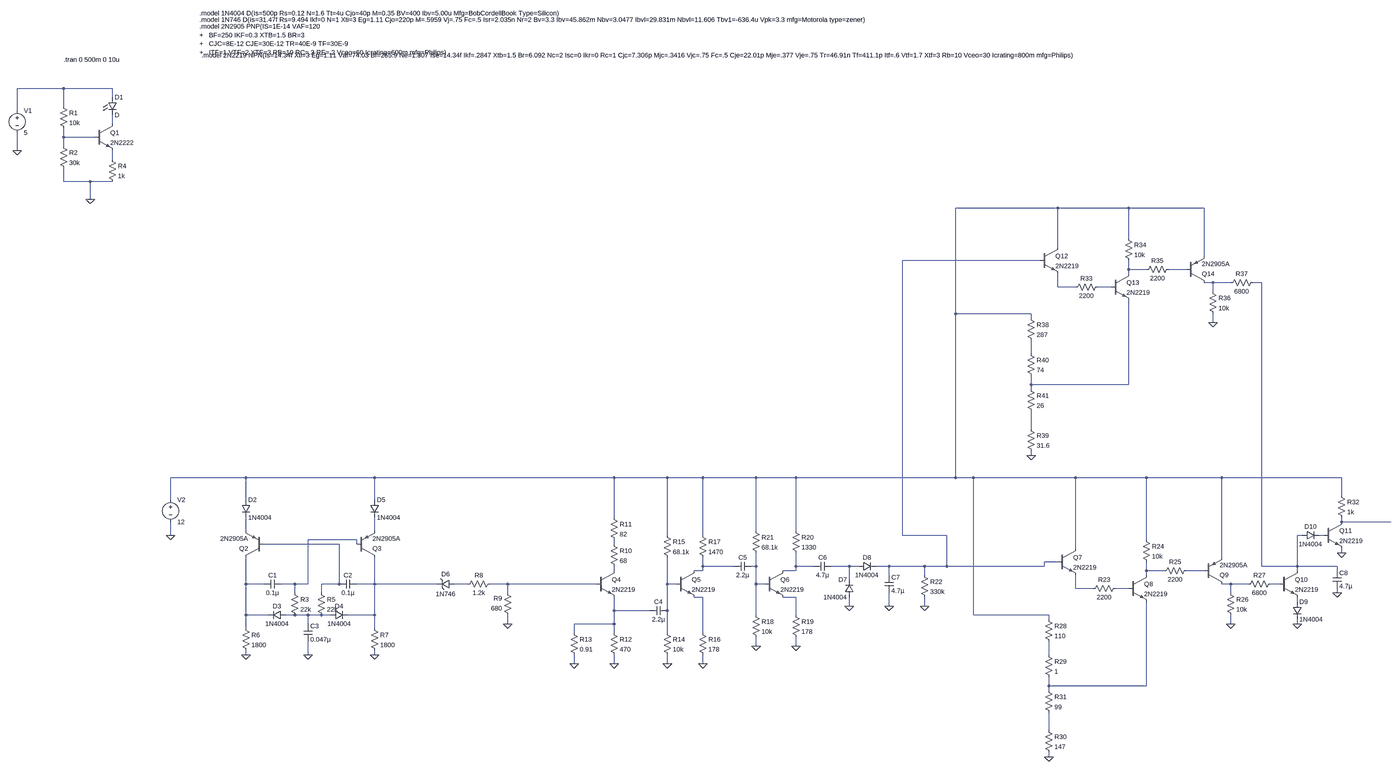
[diagram p0: schematic working_model.asc, whole sheet]
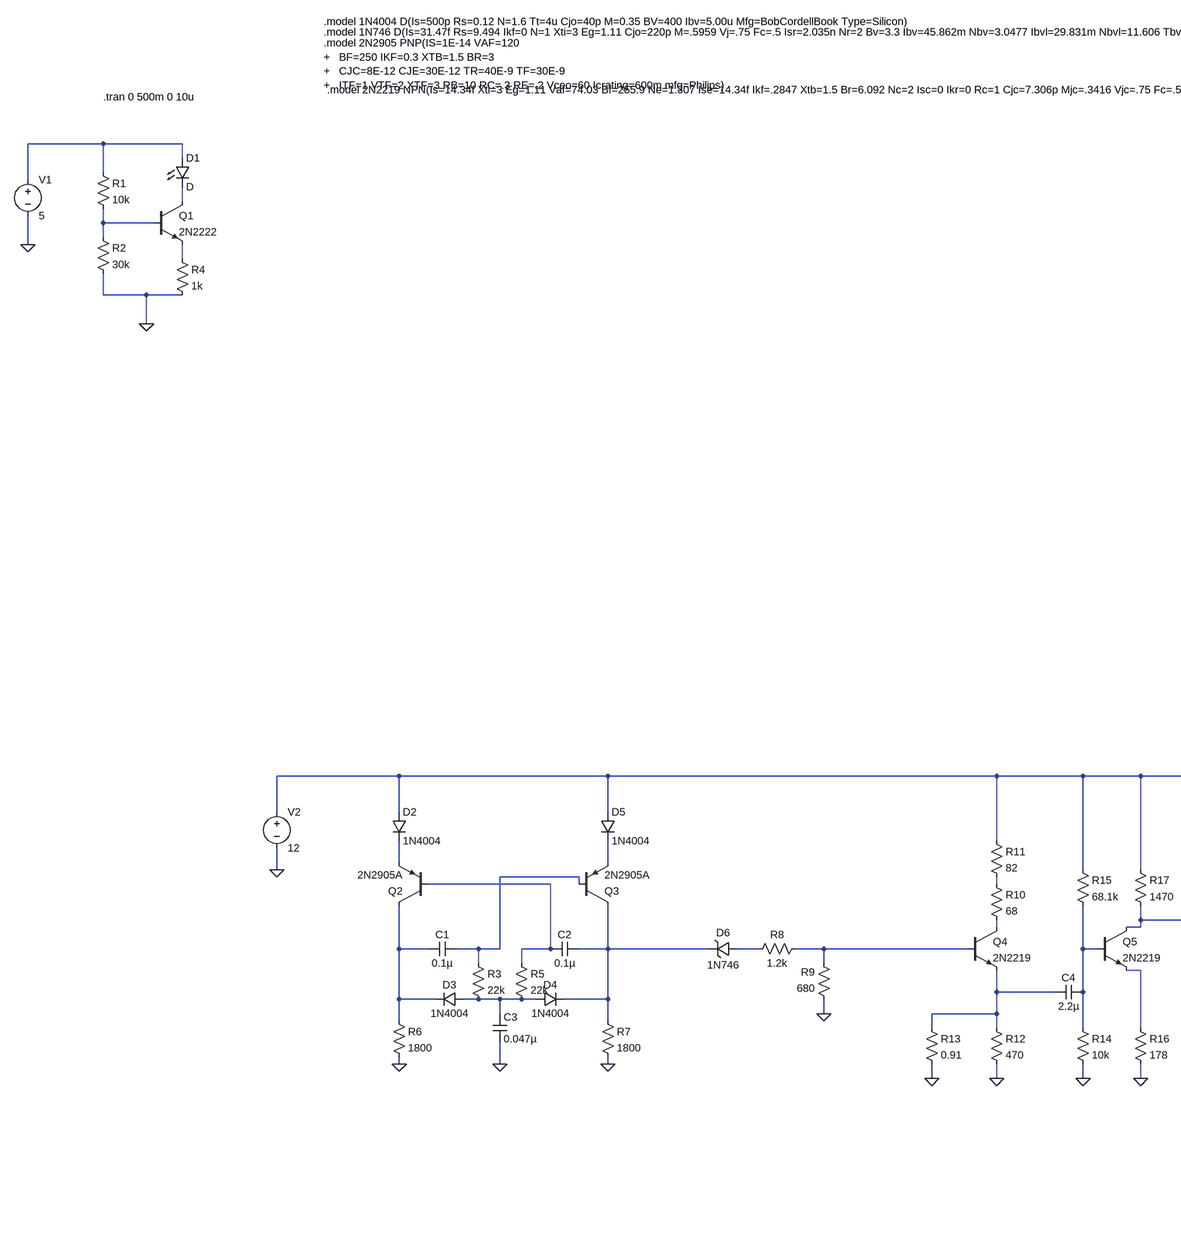
[diagram p1: schematic working_model.asc, part, row 1 of 1, column 1 of 2]
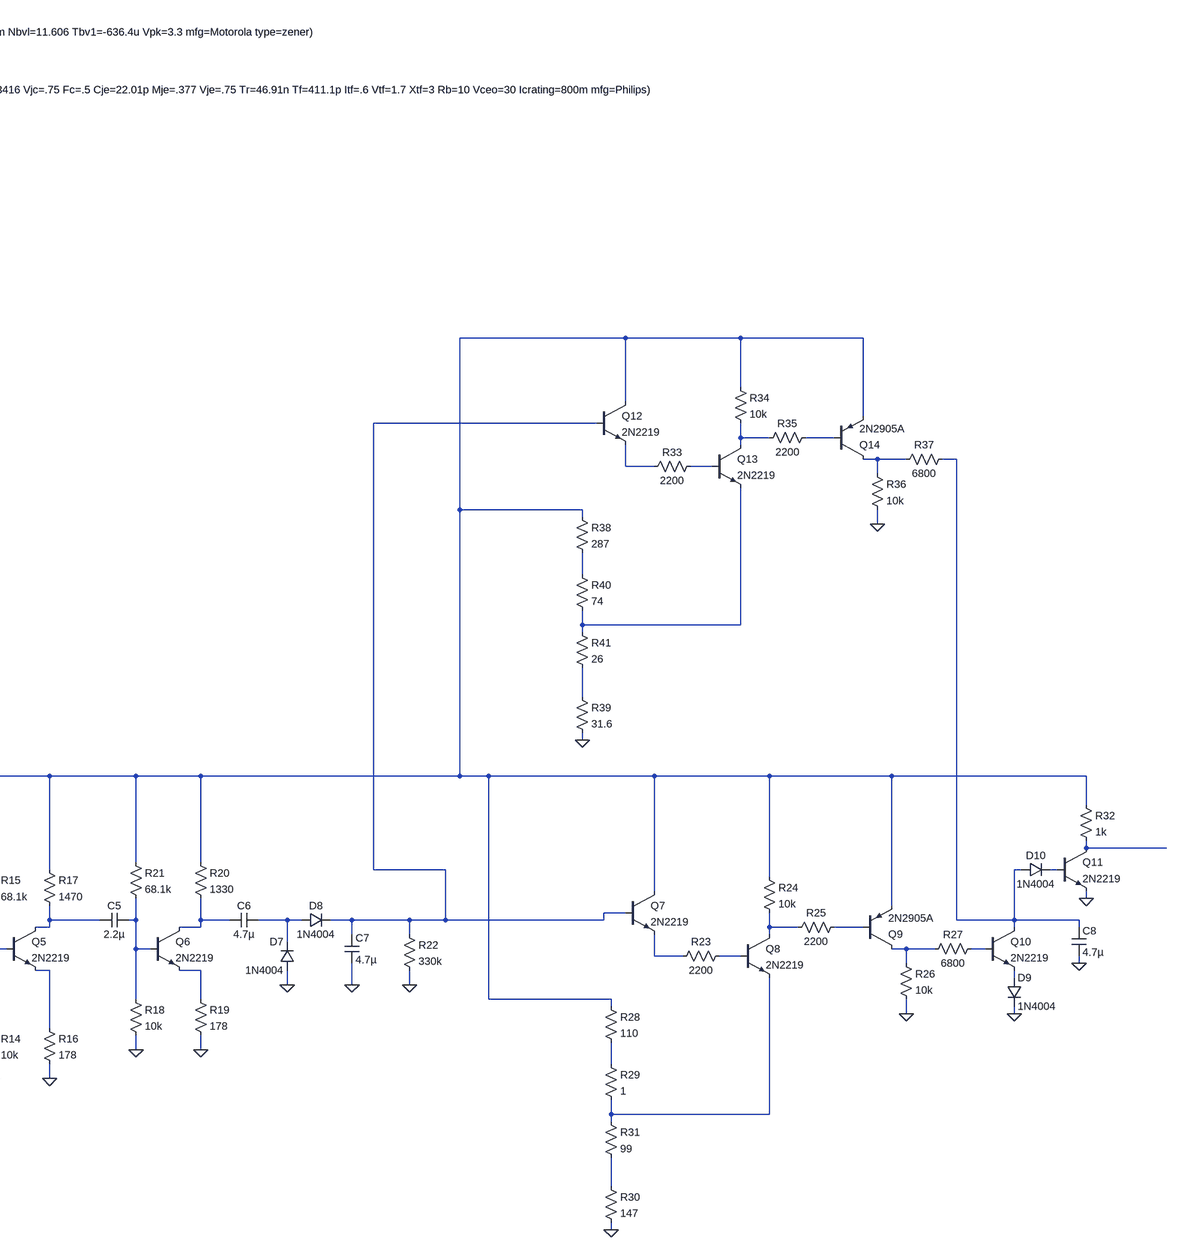
[diagram p2: schematic working_model.asc, part, row 1 of 1, column 2 of 2]
working_model.asc, the LTspice schematic file:
Version 4
SHEET 1 5364 2564
WIRE 80 16 -96 16
WIRE 256 16 80 16
WIRE 256 48 256 16
WIRE 80 80 80 16
WIRE -96 96 -96 16
WIRE 256 144 256 112
WIRE 80 192 80 160
WIRE 192 192 80 192
WIRE 80 224 80 192
WIRE -96 240 -96 176
WIRE 256 272 256 240
WIRE 80 352 80 304
WIRE 176 352 80 352
WIRE 256 352 176 352
WIRE 176 416 176 352
WIRE 4064 448 3696 448
WIRE 4320 448 4064 448
WIRE 4592 448 4320 448
WIRE 4320 672 4320 448
WIRE 4064 704 4064 448
WIRE 4592 736 4592 448
WIRE 4000 752 3504 752
WIRE 4320 784 4320 752
WIRE 4384 784 4320 784
WIRE 4528 784 4464 784
WIRE 4320 800 4320 784
WIRE 4624 832 4592 832
WIRE 4688 832 4624 832
WIRE 4800 832 4768 832
WIRE 4064 848 4064 800
WIRE 4128 848 4064 848
WIRE 4256 848 4208 848
WIRE 4624 864 4624 832
WIRE 3696 944 3696 448
WIRE 3968 944 3696 944
WIRE 3968 960 3968 944
WIRE 4624 976 4624 944
WIRE 3968 1088 3968 1040
WIRE 3968 1200 3968 1168
WIRE 4320 1200 4320 896
WIRE 4320 1200 3968 1200
WIRE 3968 1216 3968 1200
WIRE 3968 1360 3968 1296
WIRE 3968 1456 3968 1440
WIRE 1136 1536 864 1536
WIRE 1600 1536 1136 1536
WIRE 2464 1536 1600 1536
WIRE 2656 1536 2464 1536
WIRE 2784 1536 2656 1536
WIRE 2976 1536 2784 1536
WIRE 3120 1536 2976 1536
WIRE 3696 1536 3696 944
WIRE 3696 1536 3120 1536
WIRE 3760 1536 3696 1536
WIRE 4128 1536 3760 1536
WIRE 4384 1536 4128 1536
WIRE 4656 1536 4384 1536
WIRE 5088 1536 4656 1536
WIRE 5088 1600 5088 1536
WIRE 864 1616 864 1536
WIRE 1136 1616 1136 1536
WIRE 1600 1616 1600 1536
WIRE 2464 1680 2464 1536
WIRE 5088 1696 5088 1680
WIRE 5360 1696 5088 1696
WIRE 1136 1728 1136 1680
WIRE 1600 1728 1600 1680
WIRE 2976 1728 2976 1536
WIRE 3120 1728 3120 1536
WIRE 864 1744 864 1696
WIRE 2656 1744 2656 1536
WIRE 2784 1744 2784 1536
WIRE 3504 1744 3504 752
WIRE 3664 1744 3504 1744
WIRE 4944 1744 4928 1744
WIRE 5024 1744 5008 1744
WIRE 1536 1760 1360 1760
WIRE 4384 1760 4384 1536
WIRE 1472 1776 1200 1776
WIRE 1536 1776 1536 1760
WIRE 2464 1776 2464 1760
WIRE 4128 1792 4128 1536
WIRE 5088 1808 5088 1792
WIRE 4656 1824 4656 1536
WIRE 4064 1840 4016 1840
WIRE 2784 1856 2784 1824
WIRE 2896 1856 2784 1856
WIRE 2976 1856 2976 1808
WIRE 2976 1856 2960 1856
WIRE 3120 1856 3120 1808
WIRE 3184 1856 3120 1856
WIRE 3312 1856 3248 1856
WIRE 3344 1856 3312 1856
WIRE 3456 1856 3408 1856
WIRE 3584 1856 3456 1856
WIRE 3664 1856 3664 1744
WIRE 3664 1856 3584 1856
WIRE 4016 1856 4016 1840
WIRE 4016 1856 3664 1856
WIRE 4800 1856 4800 832
WIRE 4928 1856 4928 1744
WIRE 4928 1856 4800 1856
WIRE 5072 1856 4928 1856
WIRE 2464 1872 2464 1856
WIRE 2784 1872 2784 1856
WIRE 2784 1872 2752 1872
WIRE 3120 1872 3120 1856
WIRE 3120 1872 3072 1872
WIRE 4384 1872 4384 1840
WIRE 4448 1872 4384 1872
WIRE 4592 1872 4528 1872
WIRE 4928 1872 4928 1856
WIRE 5072 1872 5072 1856
WIRE 3456 1888 3456 1856
WIRE 3584 1888 3584 1856
WIRE 4384 1888 4384 1872
WIRE 3312 1904 3312 1856
WIRE 1136 1920 1136 1824
WIRE 1200 1920 1136 1920
WIRE 1312 1920 1264 1920
WIRE 1360 1920 1360 1760
WIRE 1360 1920 1312 1920
WIRE 1472 1920 1472 1776
WIRE 1472 1920 1408 1920
WIRE 1600 1920 1600 1824
WIRE 1600 1920 1536 1920
WIRE 1824 1920 1600 1920
WIRE 1936 1920 1888 1920
WIRE 2080 1920 2016 1920
WIRE 2400 1920 2080 1920
WIRE 2656 1920 2656 1824
WIRE 2688 1920 2656 1920
WIRE 2976 1920 2976 1856
WIRE 3008 1920 2976 1920
WIRE 4688 1920 4656 1920
WIRE 4752 1920 4688 1920
WIRE 4864 1920 4832 1920
WIRE 4128 1936 4128 1888
WIRE 4192 1936 4128 1936
WIRE 4320 1936 4272 1936
WIRE 1312 1952 1312 1920
WIRE 1408 1952 1408 1920
WIRE 2080 1952 2080 1920
WIRE 4688 1952 4688 1920
WIRE 5072 1952 5072 1936
WIRE 2784 1968 2752 1968
WIRE 3120 1968 3072 1968
WIRE 4928 1984 4928 1968
WIRE 3312 2000 3312 1968
WIRE 3456 2000 3456 1952
WIRE 3584 2000 3584 1968
WIRE 2464 2016 2464 1968
WIRE 2592 2016 2464 2016
WIRE 2656 2016 2656 1920
WIRE 1136 2032 1136 1920
WIRE 1216 2032 1136 2032
WIRE 1312 2032 1280 2032
WIRE 1360 2032 1312 2032
WIRE 1408 2032 1360 2032
WIRE 1440 2032 1408 2032
WIRE 1600 2032 1600 1920
WIRE 1600 2032 1504 2032
WIRE 2976 2032 2976 1920
WIRE 3120 2032 3120 1968
WIRE 3760 2032 3760 1536
WIRE 4032 2032 3760 2032
WIRE 4032 2048 4032 2032
WIRE 1360 2064 1360 2032
WIRE 2080 2064 2080 2032
WIRE 2464 2064 2464 2016
WIRE 2464 2064 2320 2064
WIRE 4688 2064 4688 2032
WIRE 4928 2064 4928 2048
WIRE 1136 2080 1136 2032
WIRE 1600 2080 1600 2032
WIRE 2320 2096 2320 2064
WIRE 2464 2096 2464 2064
WIRE 2656 2096 2656 2016
WIRE 2784 2096 2784 1968
WIRE 2976 2144 2976 2112
WIRE 3120 2144 3120 2112
WIRE 1136 2176 1136 2160
WIRE 1360 2176 1360 2128
WIRE 1600 2176 1600 2160
WIRE 4032 2176 4032 2128
WIRE 2320 2208 2320 2176
WIRE 2464 2208 2464 2176
WIRE 2656 2208 2656 2176
WIRE 2784 2208 2784 2176
WIRE 4032 2288 4032 2256
WIRE 4384 2288 4384 1984
WIRE 4384 2288 4032 2288
WIRE 4032 2304 4032 2288
WIRE 4032 2448 4032 2384
WIRE 4032 2544 4032 2528
FLAG 176 416 0
FLAG -96 240 0
FLAG 864 1744 0
FLAG 1136 2176 0
FLAG 1360 2176 0
FLAG 1600 2176 0
FLAG 2080 2064 0
FLAG 2464 2208 0
FLAG 2320 2208 0
FLAG 2656 2208 0
FLAG 2784 2208 0
FLAG 2976 2144 0
FLAG 3120 2144 0
FLAG 3312 2000 0
FLAG 3456 2000 0
FLAG 3584 2000 0
FLAG 4688 2064 0
FLAG 4928 2064 0
FLAG 4032 2544 0
FLAG 5088 1808 0
FLAG 5072 1952 0
FLAG 4624 976 0
FLAG 3968 1456 0
SYMBOL res 64 64 R0
SYMATTR InstName R1
SYMATTR Value 10k
SYMBOL res 64 208 R0
SYMATTR InstName R2
SYMATTR Value 30k
SYMBOL npn 192 144 R0
SYMATTR InstName Q1
SYMATTR Value 2N2222
SYMBOL res 240 256 R0
SYMATTR InstName R4
SYMATTR Value 1k
SYMBOL voltage -96 80 R0
WINDOW 123 0 0 Left 0
WINDOW 39 0 0 Left 0
SYMATTR InstName V1
SYMATTR Value 5
SYMBOL LED 240 48 R0
SYMATTR InstName D1
SYMBOL voltage 864 1600 R0
WINDOW 123 0 0 Left 0
WINDOW 39 0 0 Left 0
SYMATTR InstName V2
SYMATTR Value 12
SYMBOL diode 1120 1616 R0
SYMATTR InstName D2
SYMATTR Value 1N4004
SYMBOL pnp 1200 1824 R180
SYMATTR InstName Q2
SYMATTR Value 2N2905A
SYMBOL pnp 1536 1824 M180
SYMATTR InstName Q3
SYMATTR Value 2N2905A
SYMBOL cap 1264 1904 R90
WINDOW 0 0 32 VBottom 2
WINDOW 3 32 32 VTop 2
SYMATTR InstName C1
SYMATTR Value 0.1µ
SYMBOL cap 1536 1904 R90
WINDOW 0 0 32 VBottom 2
WINDOW 3 32 32 VTop 2
SYMATTR InstName C2
SYMATTR Value 0.1µ
SYMBOL res 1296 1936 R0
SYMATTR InstName R3
SYMATTR Value 22k
SYMBOL res 1392 1936 R0
SYMATTR InstName R5
SYMATTR Value 22k
SYMBOL cap 1344 2064 R0
SYMATTR InstName C3
SYMATTR Value 0.047µ
SYMBOL diode 1280 2016 R90
WINDOW 0 0 32 VBottom 2
WINDOW 3 32 32 VTop 2
SYMATTR InstName D3
SYMATTR Value 1N4004
SYMBOL diode 1440 2048 R270
WINDOW 0 32 32 VTop 2
WINDOW 3 0 32 VBottom 2
SYMATTR InstName D4
SYMATTR Value 1N4004
SYMBOL res 1120 2064 R0
SYMATTR InstName R6
SYMATTR Value 1800
SYMBOL res 1584 2064 R0
SYMATTR InstName R7
SYMATTR Value 1800
SYMBOL diode 1584 1616 R0
SYMATTR InstName D5
SYMATTR Value 1N4004
SYMBOL zener 1888 1904 R90
WINDOW 0 -4 32 VBottom 2
WINDOW 3 36 32 VTop 2
SYMATTR InstName D6
SYMATTR Value 1N746
SYMBOL res 2032 1904 R90
WINDOW 0 0 56 VBottom 2
WINDOW 3 32 56 VTop 2
SYMATTR InstName R8
SYMATTR Value 1.2k
SYMBOL res 2096 2048 R180
WINDOW 0 36 76 Left 2
WINDOW 3 36 40 Left 2
SYMATTR InstName R9
SYMATTR Value 680
SYMBOL npn 2400 1872 R0
SYMATTR InstName Q4
SYMATTR Value 2N2219
SYMBOL res 2448 1760 R0
SYMATTR InstName R10
SYMATTR Value 68
SYMBOL res 2448 1664 R0
SYMATTR InstName R11
SYMATTR Value 82
SYMBOL res 2448 2080 R0
SYMATTR InstName R12
SYMATTR Value 470
SYMBOL res 2304 2080 R0
SYMATTR InstName R13
SYMATTR Value 0.91
SYMBOL cap 2656 2000 R90
WINDOW 0 0 32 VBottom 2
WINDOW 3 32 32 VTop 2
SYMATTR InstName C4
SYMATTR Value 2.2µ
SYMBOL npn 2688 1872 R0
SYMATTR InstName Q5
SYMATTR Value 2N2219
SYMBOL res 2640 2080 R0
SYMATTR InstName R14
SYMATTR Value 10k
SYMBOL res 2640 1728 R0
SYMATTR InstName R15
SYMATTR Value 68.1k
SYMBOL res 2768 2080 R0
SYMATTR InstName R16
SYMATTR Value 178
SYMBOL res 2768 1728 R0
SYMATTR InstName R17
SYMATTR Value 1470
SYMBOL cap 2896 1872 R270
WINDOW 0 32 32 VTop 2
WINDOW 3 0 32 VBottom 2
SYMATTR InstName C5
SYMATTR Value 2.2µ
SYMBOL npn 3008 1872 R0
SYMATTR InstName Q6
SYMATTR Value 2N2219
SYMBOL res 2960 2016 R0
SYMATTR InstName R18
SYMATTR Value 10k
SYMBOL res 3104 2016 R0
SYMATTR InstName R19
SYMATTR Value 178
SYMBOL res 3104 1712 R0
SYMATTR InstName R20
SYMATTR Value 1330
SYMBOL res 2960 1712 R0
SYMATTR InstName R21
SYMATTR Value 68.1k
SYMBOL cap 3248 1840 R90
WINDOW 0 0 32 VBottom 2
WINDOW 3 32 32 VTop 2
SYMATTR InstName C6
SYMATTR Value 4.7µ
SYMBOL diode 3328 1968 R180
WINDOW 0 24 64 Left 2
WINDOW 3 24 0 Left 2
SYMATTR InstName D7
SYMATTR Value 1N4004
SYMBOL diode 3344 1872 R270
WINDOW 0 32 32 VTop 2
WINDOW 3 0 32 VBottom 2
SYMATTR InstName D8
SYMATTR Value 1N4004
SYMBOL cap 3440 1888 R0
SYMATTR InstName C7
SYMATTR Value 4.7µ
SYMBOL res 3568 1872 R0
SYMATTR InstName R22
SYMATTR Value 330k
SYMBOL npn 4064 1792 R0
SYMATTR InstName Q7
SYMATTR Value 2N2219
SYMBOL res 4288 1920 R90
WINDOW 0 0 56 VBottom 2
WINDOW 3 32 56 VTop 2
SYMATTR InstName R23
SYMATTR Value 2200
SYMBOL npn 4320 1888 R0
SYMATTR InstName Q8
SYMATTR Value 2N2219
SYMBOL res 4368 1744 R0
SYMATTR InstName R24
SYMATTR Value 10k
SYMBOL res 4544 1856 R90
WINDOW 0 0 56 VBottom 2
WINDOW 3 32 56 VTop 2
SYMATTR InstName R25
SYMATTR Value 2200
SYMBOL pnp 4592 1920 M180
SYMATTR InstName Q9
SYMATTR Value 2N2905A
SYMBOL res 4672 1936 R0
SYMATTR InstName R26
SYMATTR Value 10k
SYMBOL res 4848 1904 R90
WINDOW 0 0 56 VBottom 2
WINDOW 3 32 56 VTop 2
SYMATTR InstName R27
SYMATTR Value 6800
SYMBOL npn 4864 1872 R0
SYMATTR InstName Q10
SYMATTR Value 2N2219
SYMBOL diode 4912 1984 R0
SYMATTR InstName D9
SYMATTR Value 1N4004
SYMBOL res 4016 2032 R0
SYMATTR InstName R28
SYMATTR Value 110
SYMBOL res 4016 2432 R0
SYMATTR InstName R30
SYMATTR Value 147
SYMBOL res 4016 2160 R0
SYMATTR InstName R29
SYMATTR Value 1
SYMBOL res 4016 2288 R0
SYMATTR InstName R31
SYMATTR Value 99
SYMBOL diode 4944 1760 R270
WINDOW 0 32 32 VTop 2
WINDOW 3 0 32 VBottom 2
SYMATTR InstName D10
SYMATTR Value 1N4004
SYMBOL npn 5024 1696 R0
SYMATTR InstName Q11
SYMATTR Value 2N2219
SYMBOL res 5072 1584 R0
SYMATTR InstName R32
SYMATTR Value 1k
SYMBOL cap 5056 1872 R0
SYMATTR InstName C8
SYMATTR Value 4.7µ
SYMBOL npn 4000 704 R0
SYMATTR InstName Q12
SYMATTR Value 2N2219
SYMBOL res 4224 832 R90
WINDOW 0 0 56 VBottom 2
WINDOW 3 32 56 VTop 2
SYMATTR InstName R33
SYMATTR Value 2200
SYMBOL npn 4256 800 R0
SYMATTR InstName Q13
SYMATTR Value 2N2219
SYMBOL res 4304 656 R0
SYMATTR InstName R34
SYMATTR Value 10k
SYMBOL res 4480 768 R90
WINDOW 0 0 56 VBottom 2
WINDOW 3 32 56 VTop 2
SYMATTR InstName R35
SYMATTR Value 2200
SYMBOL pnp 4528 832 M180
SYMATTR InstName Q14
SYMATTR Value 2N2905A
SYMBOL res 4608 848 R0
SYMATTR InstName R36
SYMATTR Value 10k
SYMBOL res 4784 816 R90
WINDOW 0 0 56 VBottom 2
WINDOW 3 32 56 VTop 2
SYMATTR InstName R37
SYMATTR Value 6800
SYMBOL res 3952 944 R0
SYMATTR InstName R38
SYMATTR Value 287
SYMBOL res 3952 1344 R0
SYMATTR InstName R39
SYMATTR Value 31.6
SYMBOL res 3952 1072 R0
SYMATTR InstName R40
SYMATTR Value 74
SYMBOL res 3952 1200 R0
SYMATTR InstName R41
SYMATTR Value 26
TEXT 80 -88 Left 2 !.tran 0 500m 0 10u
TEXT 968 -256 Left 2 !.model 1N4004 D(Is=500p Rs=0.12 N=1.6 Tt=4u Cjo=40p M=0.35 BV=400 Ibv=5.00u Mfg=BobCordellBook Type=Silicon)
TEXT 968 -232 Left 2 !.model 1N746 D(Is=31.47f Rs=9.494 Ikf=0 N=1 Xti=3 Eg=1.11 Cjo=220p M=.5959 Vj=.75 Fc=.5 Isr=2.035n Nr=2 Bv=3.3 Ibv=45.862m Nbv=3.0477 Ibvl=29.831m Nbvl=11.606 Tbv1=-636.4u Vpk=3.3 mfg=Motorola type=zener)
TEXT 968 -208 Left 2 !.model 2N2905 PNP(IS=1E-14 VAF=120\n+   BF=250 IKF=0.3 XTB=1.5 BR=3\n+   CJC=8E-12 CJE=30E-12 TR=40E-9 TF=30E-9\n+   ITF=1 VTF=2 XTF=3 RB=10 RC=.3 RE=.2 Vceo=60 Icrating=600m mfg=Philips)
TEXT 976 -104 Left 2 !.model 2N2219 NPN(Is=14.34f Xti=3 Eg=1.11 Vaf=74.03 Bf=255.9 Ne=1.307 Ise=14.34f Ikf=.2847 Xtb=1.5 Br=6.092 Nc=2 Isc=0 Ikr=0 Rc=1 Cjc=7.306p Mjc=.3416 Vjc=.75 Fc=.5 Cje=22.01p Mje=.377 Vje=.75 Tr=46.91n Tf=411.1p Itf=.6 Vtf=1.7 Xtf=3 Rb=10 Vceo=30 Icrating=800m mfg=Philips)

The netlist it stands for:
* working_model.asc
R1 N001 N003 10k
R2 N003 0 30k
Q1 N002 N003 N004 0 2N2222
R4 N004 0 1k
V1 N001 0 5
D1 N001 N002 D
V2 N005 0 12
D2 N005 N017 1N4004
Q2 N030 N021 N017 0 2N2905A
Q3 N031 N020 N018 0 2N2905A
C1 N020 N030 0.1µ
C2 N031 N021 0.1µ
R3 N020 N043 22k
R5 N021 N043 22k
C3 N043 0 0.047µ
D3 N043 N030 1N4004
D4 N043 N031 1N4004
R6 N030 0 1800
R7 N031 0 1800
D5 N005 N018 1N4004
D6 N032 N031 1N746
R8 N033 N032 1.2k
R9 0 N033 680
Q4 N027 N033 N042 0 2N2219
R10 N022 N027 68
R11 N005 N022 82
R12 N042 0 470
R13 N042 0 0.91
C4 N034 N042 2.2µ
Q5 N023 N034 N039 0 2N2219
R14 N034 0 10k
R15 N005 N034 68.1k
R16 N039 0 178
R17 N005 N023 1470
C5 N023 N024 2.2µ
Q6 N025 N024 N040 0 2N2219
R18 N024 0 10k
R19 N040 0 178
R20 N005 N025 1330
R21 N005 N024 68.1k
C6 N026 N025 4.7µ
D7 0 N026 1N4004
D8 N026 N006 1N4004
C7 N006 0 4.7µ
R22 N006 0 330k
Q7 N005 N006 N037 0 2N2219
R23 N038 N037 2200
Q8 N028 N038 N045 0 2N2219
R24 N005 N028 10k
R25 N029 N028 2200
Q9 N035 N029 N005 0 2N2905A
R26 N035 0 10k
R27 N036 N035 6800
Q10 N010 N036 N041 0 2N2219
D9 N041 0 1N4004
R28 N005 N044 110
R30 N046 0 147
R29 N044 N045 1
R31 N045 N046 99
D10 N010 N019 1N4004
Q11 N016 N019 0 0 2N2219
R32 N005 N016 1k
C8 N010 0 4.7µ
Q12 N005 N006 N011 0 2N2219
R33 N012 N011 2200
Q13 N007 N012 N014 0 2N2219
R34 N005 N007 10k
R35 N008 N007 2200
Q14 N009 N008 N005 0 2N2905A
R36 N009 0 10k
R37 N010 N009 6800
R38 N005 N013 287
R39 N015 0 31.6
R40 N013 N014 74
R41 N014 N015 26
.model D D
.lib standard.dio
.model NPN NPN
.model PNP PNP
.lib standard.bjt
.tran 0 500m 0 10u
.model 1N4004 D(Is=500p Rs=0.12 N=1.6 Tt=4u Cjo=40p M=0.35 BV=400 Ibv=5.00u Mfg=BobCordellBook Type=Silicon)
.model 1N746 D(Is=31.47f Rs=9.494 Ikf=0 N=1 Xti=3 Eg=1.11 Cjo=220p M=.5959 Vj=.75 Fc=.5 Isr=2.035n Nr=2 Bv=3.3 Ibv=45.862m Nbv=3.0477 Ibvl=29.831m Nbvl=11.606 Tbv1=-636.4u Vpk=3.3 mfg=Motorola type=zener)
.model 2N2905 PNP(IS=1E-14 VAF=120
+   BF=250 IKF=0.3 XTB=1.5 BR=3
+   CJC=8E-12 CJE=30E-12 TR=40E-9 TF=30E-9
+   ITF=1 VTF=2 XTF=3 RB=10 RC=.3 RE=.2 Vceo=60 Icrating=600m mfg=Philips)
.model 2N2219 NPN(Is=14.34f Xti=3 Eg=1.11 Vaf=74.03 Bf=255.9 Ne=1.307 Ise=14.34f Ikf=.2847 Xtb=1.5 Br=6.092 Nc=2 Isc=0 Ikr=0 Rc=1 Cjc=7.306p Mjc=.3416 Vjc=.75 Fc=.5 Cje=22.01p Mje=.377 Vje=.75 Tr=46.91n Tf=411.1p Itf=.6 Vtf=1.7 Xtf=3 Rb=10 Vceo=30 Icrating=800m mfg=Philips)
.backanno
.end